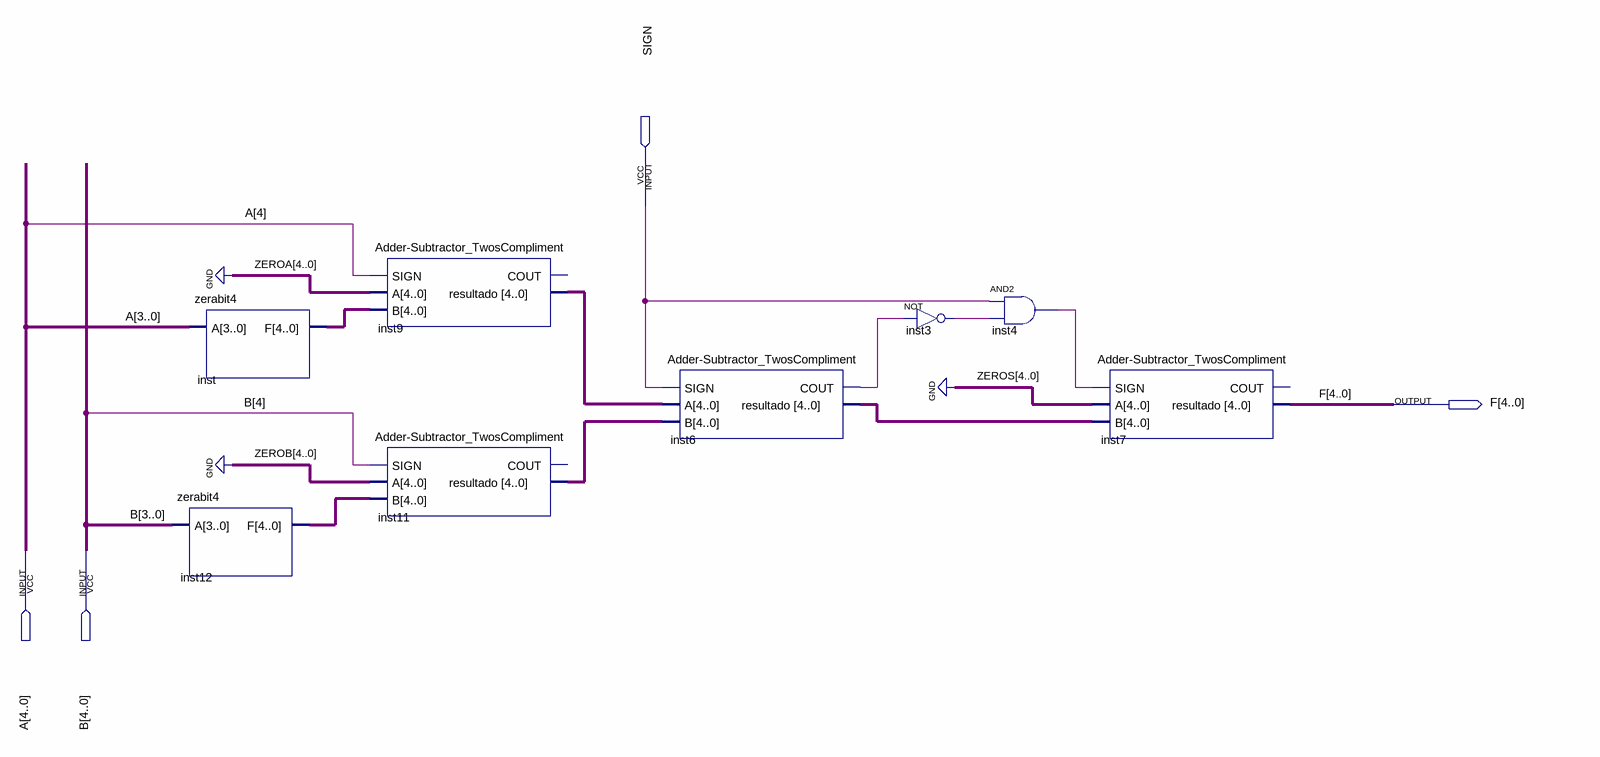
[diagram p0: schematic sheet]
// Quartus schematic Adder-Subtractor.bdf as structural Verilog: 8 symbols, 4 pins
module \Adder-Subtractor  (
  input  SIGN,
  input  [4:0] A,
  input  [4:0] B,
  output [4:0] F
);

  wire inst3_out, inst4_out, inst6_cout;
  wire [4:0] inst6_resultado, inst9_resultado, inst11_resultado, inst12_f, inst_f;

  zerabit4 inst (.A(A[3:0]), .F(inst_f));
  zerabit4 inst12 (.A(B[3:0]), .F(inst12_f));
  \Adder-Subtractor_TwosCompliment  inst9 (
    .SIGN(A[4]), .A({5{1'b0}}), .B(inst_f), .resultado(inst9_resultado));  // open: COUT
  \Adder-Subtractor_TwosCompliment  inst11 (
    .SIGN(B[4]), .A({5{1'b0}}), .B(inst12_f), .resultado(inst11_resultado));  // open: COUT
  \Adder-Subtractor_TwosCompliment  inst6 (
    .SIGN(SIGN), .A(inst9_resultado), .B(inst11_resultado), .COUT(inst6_cout), .resultado(inst6_resultado));
  not inst3 (inst3_out, inst6_cout);
  and inst4 (inst4_out, SIGN, inst3_out);
  \Adder-Subtractor_TwosCompliment  inst7 (
    .SIGN(inst4_out), .A({5{1'b0}}), .B(inst6_resultado), .resultado(F));  // open: COUT
endmodule
